# Altium schematic sheet SAM3X-MCU.SchDoc
size A2; DocumentNumber: 1; SheetNumber: 2; SheetTotal: 8
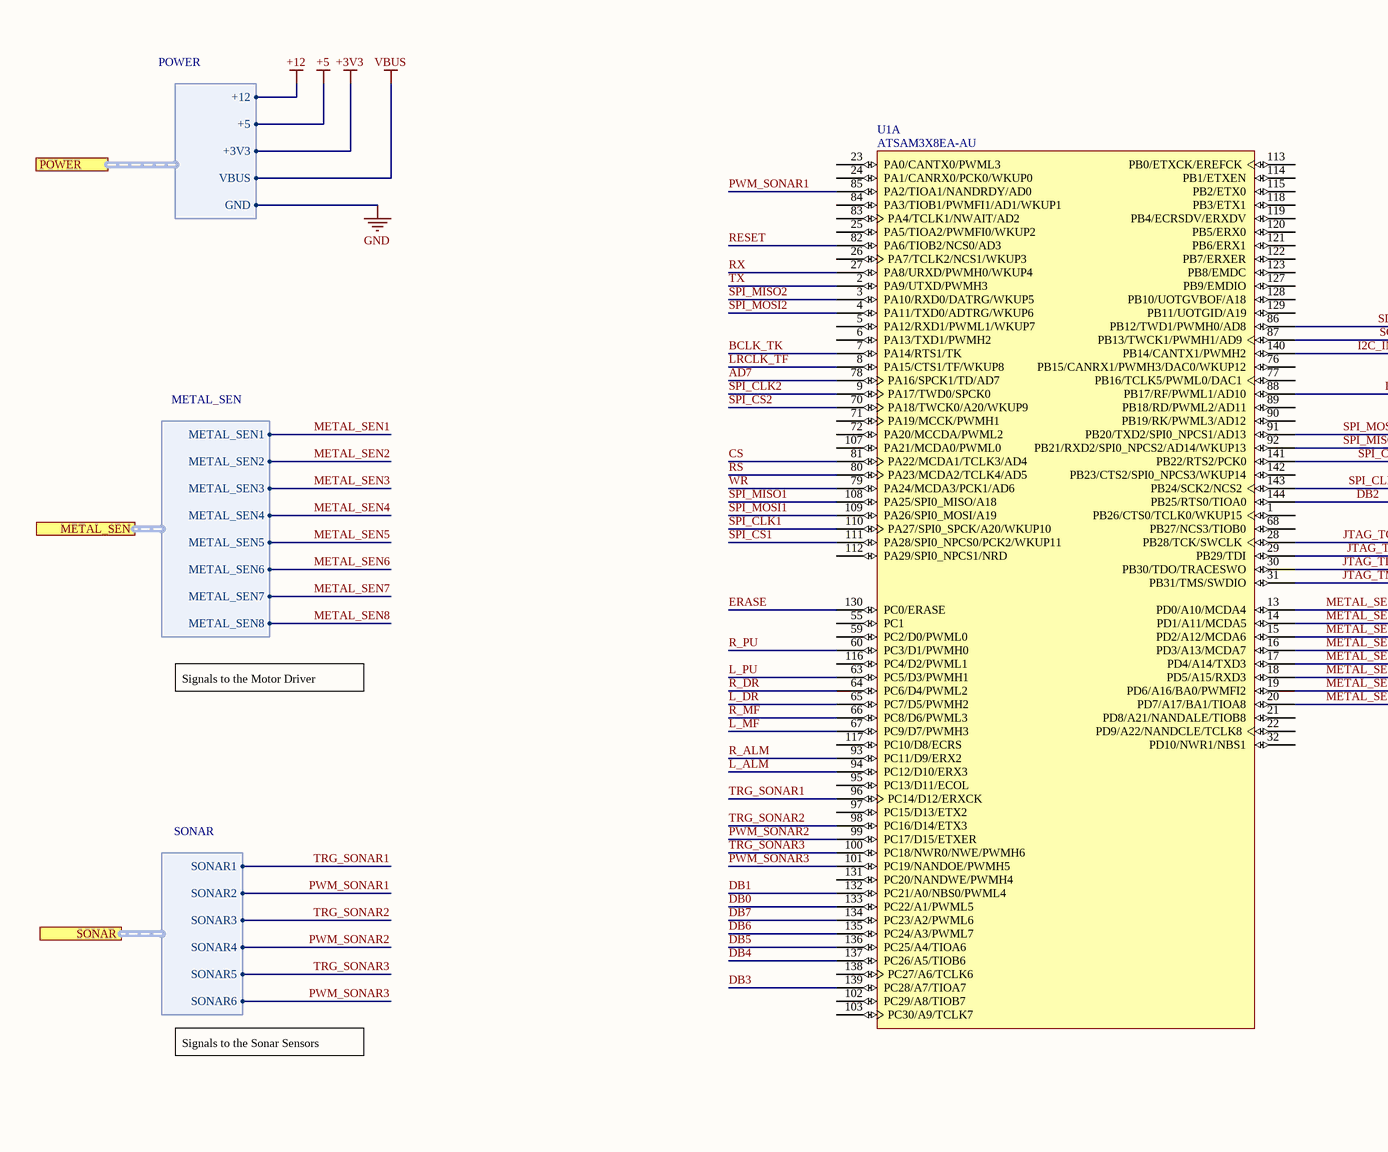
[diagram p0: SAM3X-MCU.SchDoc, left]
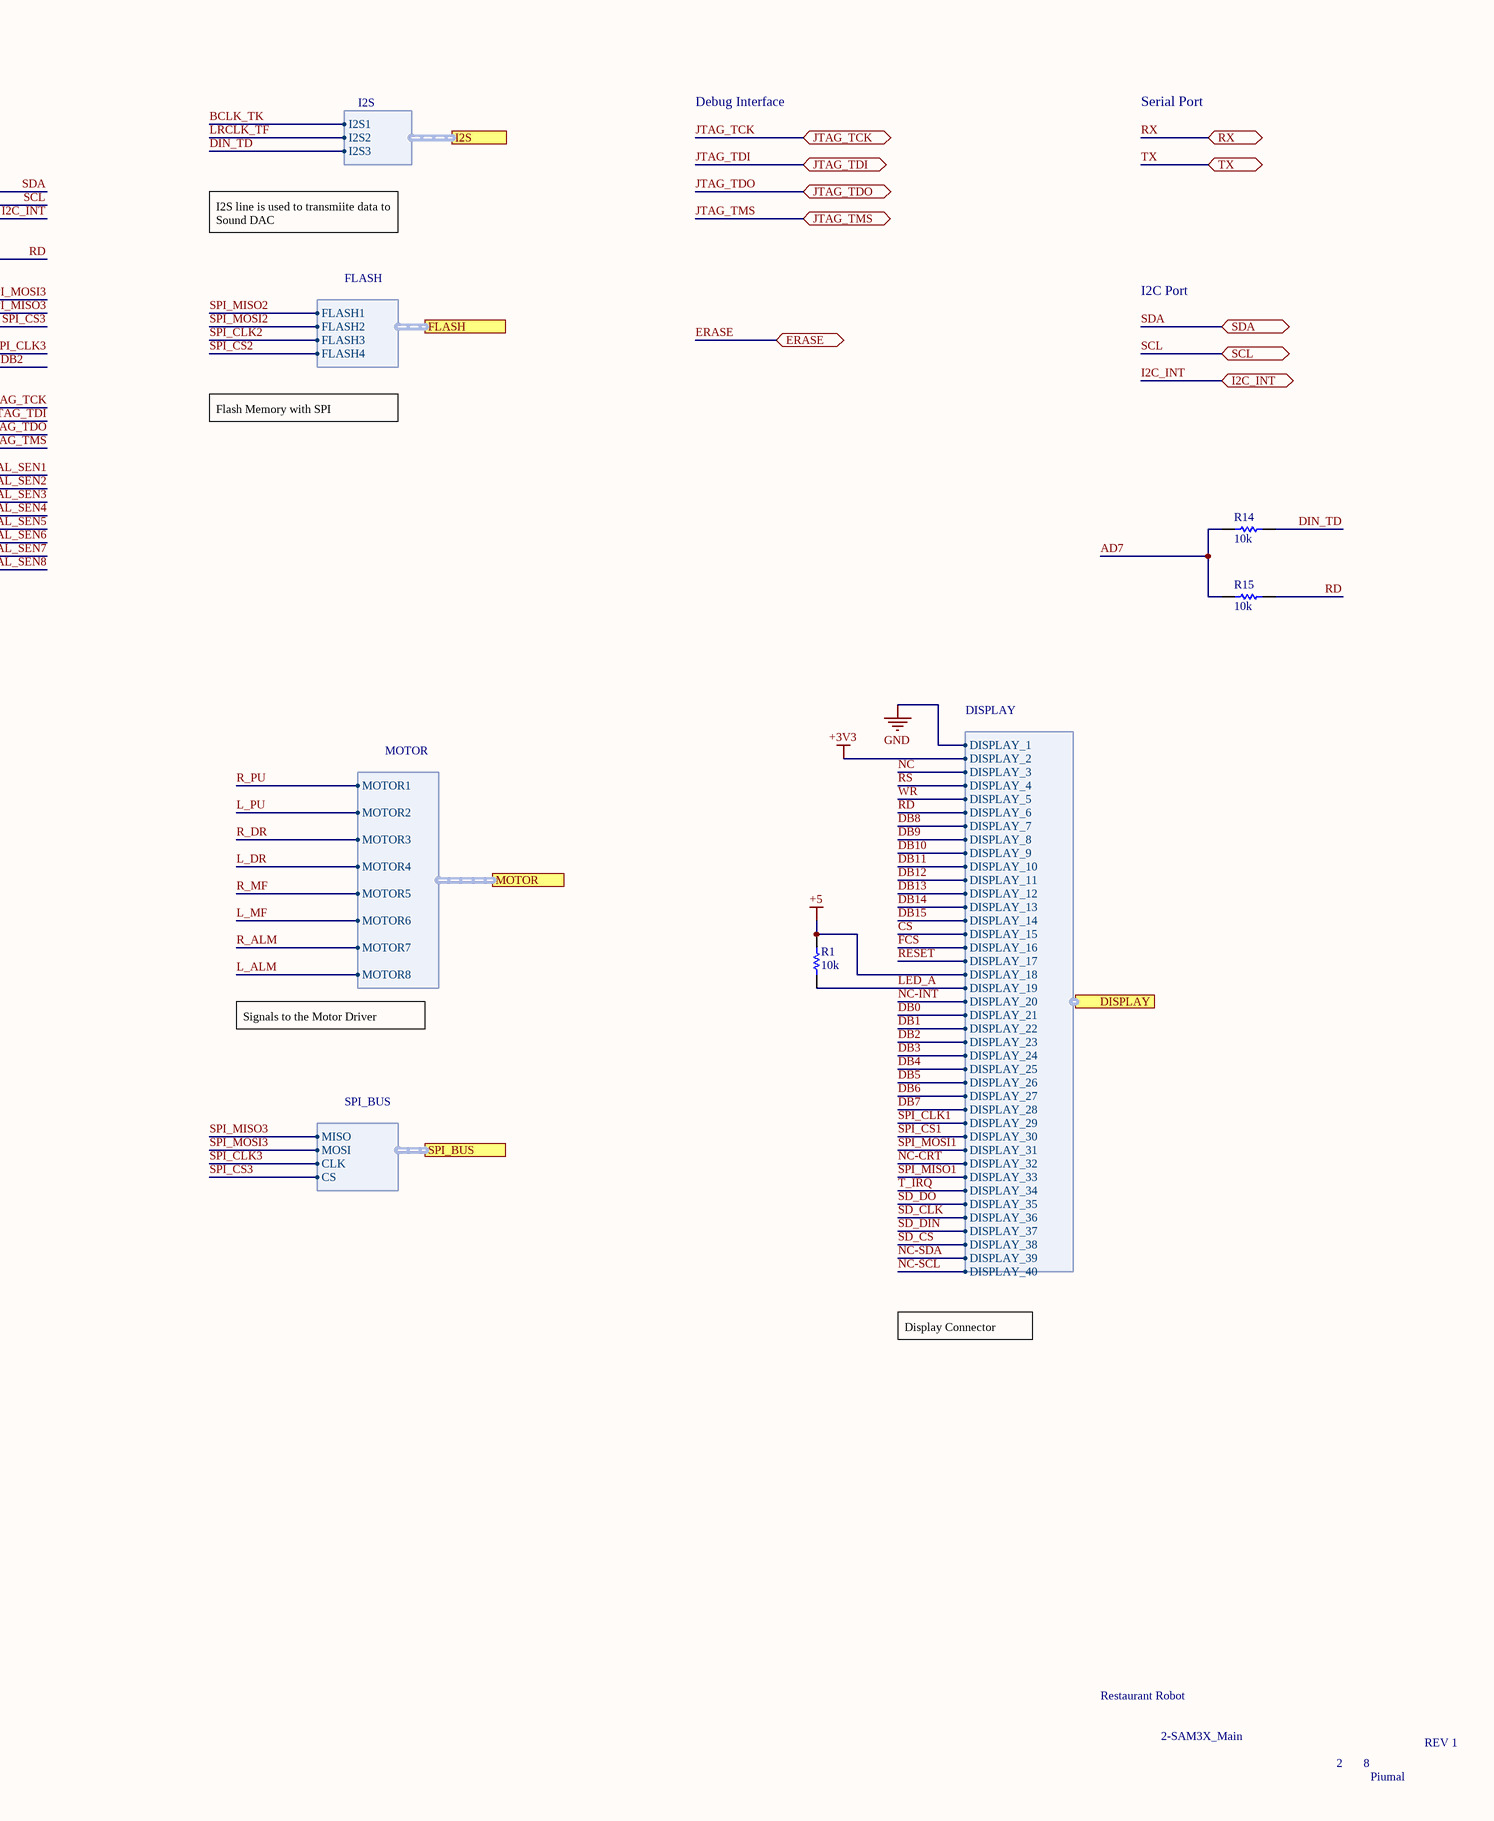
[diagram p1: SAM3X-MCU.SchDoc, right]

## Parts
R1  Resistance: 10k  [RESC2013X60X35ML10T20]  (hidden comment: RC0805JR-0710KL)
R14  Resistance: 10k  [RESC2013X60X35ML10T20]  (hidden comment: RC0805JR-0710KL)
R15  Resistance: 10k  [RESC2013X60X35ML10T20]  (hidden comment: RC0805JR-0710KL)
U1  ATSAM3X8EA-AU  [LQFP144_M]  (part A of 3)

## Ports
DISPLAY (harness DISPLAY), ERASE (bidir), FLASH (harness FLASH), I2C_INT (bidir), I2S (harness I2S), JTAG_TCK (bidir), JTAG_TDI (bidir), JTAG_TDO (bidir), JTAG_TMS (bidir), METAL_SEN (harness METAL_SEN), MOTOR (harness MOTOR), POWER (harness POWER), RX (bidir), SCL (bidir), SDA (bidir), SONAR (harness SONAR), SPI_BUS (harness SPI_BUS), TX (bidir)

## Harnesses
MOTOR: MOTOR1, MOTOR2, MOTOR3, MOTOR4, MOTOR5, MOTOR6, MOTOR7, MOTOR8
FLASH: FLASH1, FLASH2, FLASH3, FLASH4
SONAR: SONAR1, SONAR2, SONAR3, SONAR4, SONAR5, SONAR6
I2S: I2S1, I2S2, I2S3
METAL_SEN: METAL_SEN1, METAL_SEN2, METAL_SEN3, METAL_SEN4, METAL_SEN5, METAL_SEN6, METAL_SEN7, METAL_SEN8
DISPLAY: DISPLAY_1, DISPLAY_2, DISPLAY_3, DISPLAY_4, DISPLAY_5, DISPLAY_6, DISPLAY_7, DISPLAY_8, DISPLAY_9, DISPLAY_10, DISPLAY_11, DISPLAY_12, DISPLAY_13, DISPLAY_14, DISPLAY_15, DISPLAY_16, DISPLAY_18, DISPLAY_17, DISPLAY_19, DISPLAY_20, DISPLAY_21, DISPLAY_22, DISPLAY_23, DISPLAY_24, DISPLAY_25, DISPLAY_26, DISPLAY_27, DISPLAY_28, DISPLAY_29, DISPLAY_30, DISPLAY_31, DISPLAY_32, DISPLAY_33, DISPLAY_34, DISPLAY_35, DISPLAY_36, DISPLAY_37, DISPLAY_39, DISPLAY_38, DISPLAY_40
SPI_BUS: MISO, MOSI, CLK, CS
POWER: +3V3, GND, +5, VBUS, +12

## Nets
+3V3: port DISPLAY.DISPLAY_2, port POWER.+3V3
+5: R1.2 ; port DISPLAY.DISPLAY_18, port POWER.+5
+12: port POWER.+12
GND: port DISPLAY.DISPLAY_1, port POWER.GND
VBUS: port POWER.VBUS
AD7: R14.2 R15.2 U1.78(PA16/SPCK1/TD/AD7)
BCLK_TK: U1.7(PA14/RTS1/TK) ; port I2S.I2S1
CS: U1.81(PA22/MCDA1/TCLK3/AD4) ; port DISPLAY.DISPLAY_15
DB0: U1.133(PC22/A1/PWML5) ; port DISPLAY.DISPLAY_21
DB1: U1.132(PC21/A0/NBS0/PWML4) ; port DISPLAY.DISPLAY_22
DB2: U1.144(PB25/RTS0/TIOA0) ; port DISPLAY.DISPLAY_23
DB3: U1.139(PC28/A7/TIOA7) ; port DISPLAY.DISPLAY_24
DB4: U1.137(PC26/A5/TIOB6) ; port DISPLAY.DISPLAY_25
DB5: U1.136(PC25/A4/TIOA6) ; port DISPLAY.DISPLAY_26
DB6: U1.135(PC24/A3/PWML7) ; port DISPLAY.DISPLAY_27
DB7: U1.134(PC23/A2/PWML6) ; port DISPLAY.DISPLAY_28
DB8: port DISPLAY.DISPLAY_7
DB9: port DISPLAY.DISPLAY_8
DB10: port DISPLAY.DISPLAY_9
DB11: port DISPLAY.DISPLAY_10
DB12: port DISPLAY.DISPLAY_11
DB13: port DISPLAY.DISPLAY_12
DB14: port DISPLAY.DISPLAY_13
DB15: port DISPLAY.DISPLAY_14
DIN_TD: R14.1 ; port I2S.I2S3
ERASE: U1.130(PC0/ERASE) ; port ERASE
FCS: port DISPLAY.DISPLAY_16
I2C_INT: U1.140(PB14/CANTX1/PWMH2) ; port I2C_INT
JTAG_TCK: U1.28(PB28/TCK/SWCLK) ; port JTAG_TCK
JTAG_TDI: U1.29(PB29/TDI) ; port JTAG_TDI
JTAG_TDO: U1.30(PB30/TDO/TRACESWO) ; port JTAG_TDO
JTAG_TMS: U1.31(PB31/TMS/SWDIO) ; port JTAG_TMS
L_ALM: U1.94(PC12/D10/ERX3) ; port MOTOR.MOTOR8
L_DR: U1.65(PC7/D5/PWMH2) ; port MOTOR.MOTOR4
L_MF: U1.67(PC9/D7/PWMH3) ; port MOTOR.MOTOR6
L_PU: U1.63(PC5/D3/PWMH1) ; port MOTOR.MOTOR2
LED_A: R1.1 ; port DISPLAY.DISPLAY_19
LRCLK_TF: U1.8(PA15/CTS1/TF/WKUP8) ; port I2S.I2S2
METAL_SEN1: U1.13(PD0/A10/MCDA4) ; port METAL_SEN.METAL_SEN1
METAL_SEN2: U1.14(PD1/A11/MCDA5) ; port METAL_SEN.METAL_SEN2
METAL_SEN3: U1.15(PD2/A12/MCDA6) ; port METAL_SEN.METAL_SEN3
METAL_SEN4: U1.16(PD3/A13/MCDA7) ; port METAL_SEN.METAL_SEN4
METAL_SEN5: U1.17(PD4/A14/TXD3) ; port METAL_SEN.METAL_SEN5
METAL_SEN6: U1.18(PD5/A15/RXD3) ; port METAL_SEN.METAL_SEN6
METAL_SEN7: U1.19(PD6/A16/BA0/PWMFI2) ; port METAL_SEN.METAL_SEN7
METAL_SEN8: U1.20(PD7/A17/BA1/TIOA8) ; port METAL_SEN.METAL_SEN8
NC: port DISPLAY.DISPLAY_3
NC-CRT: port DISPLAY.DISPLAY_32
NC-INT: port DISPLAY.DISPLAY_20
NC-SCL: port DISPLAY.DISPLAY_40
NC-SDA: port DISPLAY.DISPLAY_39
PWM_SONAR1: U1.85(PA2/TIOA1/NANDRDY/AD0) ; port SONAR.SONAR2
PWM_SONAR2: U1.99(PC17/D15/ETXER) ; port SONAR.SONAR4
PWM_SONAR3: U1.101(PC19/NANDOE/PWMH5) ; port SONAR.SONAR6
R_ALM: U1.93(PC11/D9/ERX2) ; port MOTOR.MOTOR7
R_DR: U1.64(PC6/D4/PWML2) ; port MOTOR.MOTOR3
R_MF: U1.66(PC8/D6/PWML3) ; port MOTOR.MOTOR5
R_PU: U1.60(PC3/D1/PWMH0) ; port MOTOR.MOTOR1
RD: R15.1 U1.88(PB17/RF/PWML1/AD10) ; port DISPLAY.DISPLAY_6
RESET: U1.82(PA6/TIOB2/NCS0/AD3) ; port DISPLAY.DISPLAY_17
RS: U1.80(PA23/MCDA2/TCLK4/AD5) ; port DISPLAY.DISPLAY_4
RX: U1.27(PA8/URXD/PWMH0/WKUP4) ; port RX
SCL: U1.87(PB13/TWCK1/PWMH1/AD9) ; port SCL
SD_CLK: port DISPLAY.DISPLAY_36
SD_CS: port DISPLAY.DISPLAY_38
SD_DIN: port DISPLAY.DISPLAY_37
SD_DO: port DISPLAY.DISPLAY_35
SDA: U1.86(PB12/TWD1/PWMH0/AD8) ; port SDA
SPI_CLK1: U1.110(PA27/SPI0_SPCK/A20/WKUP10) ; port DISPLAY.DISPLAY_29
SPI_CLK2: U1.9(PA17/TWD0/SPCK0) ; port FLASH.FLASH3
SPI_CLK3: U1.143(PB24/SCK2/NCS2) ; port SPI_BUS.CLK
SPI_CS1: U1.111(PA28/SPI0_NPCS0/PCK2/WKUP11) ; port DISPLAY.DISPLAY_30
SPI_CS2: U1.70(PA18/TWCK0/A20/WKUP9) ; port FLASH.FLASH4
SPI_CS3: U1.141(PB22/RTS2/PCK0) ; port SPI_BUS.CS
SPI_MISO1: U1.108(PA25/SPI0_MISO/A18) ; port DISPLAY.DISPLAY_33
SPI_MISO2: U1.3(PA10/RXD0/DATRG/WKUP5) ; port FLASH.FLASH1
SPI_MISO3: U1.92(PB21/RXD2/SPI0_NPCS2/AD14/WKUP13) ; port SPI_BUS.MISO
SPI_MOSI1: U1.109(PA26/SPI0_MOSI/A19) ; port DISPLAY.DISPLAY_31
SPI_MOSI2: U1.4(PA11/TXD0/ADTRG/WKUP6) ; port FLASH.FLASH2
SPI_MOSI3: U1.91(PB20/TXD2/SPI0_NPCS1/AD13) ; port SPI_BUS.MOSI
T_IRQ: port DISPLAY.DISPLAY_34
TRG_SONAR1: U1.96(PC14/D12/ERXCK) ; port SONAR.SONAR1
TRG_SONAR2: U1.98(PC16/D14/ETX3) ; port SONAR.SONAR3
TRG_SONAR3: U1.100(PC18/NWR0/NWE/PWMH6) ; port SONAR.SONAR5
TX: U1.2(PA9/UTXD/PWMH3) ; port TX
WR: U1.79(PA24/MCDA3/PCK1/AD6) ; port DISPLAY.DISPLAY_5

Not connected (* = marked no-connect by the designer): U1 1(PB26/CTS0/TCLK0/WKUP15) 5(PA12/RXD1/PWML1/WKUP7) 6(PA13/TXD1/PWMH2) 21(PD8/A21/NANDALE/TIOB8) 22(PD9/A22/NANDCLE/TCLK8) 23(PA0/CANTX0/PWML3) 24(PA1/CANRX0/PCK0/WKUP0) 25(PA5/TIOA2/PWMFI0/WKUP2) 26(PA7/TCLK2/NCS1/WKUP3) 32(PD10/NWR1/NBS1) 55(PC1) 59(PC2/D0/PWML0) 68(PB27/NCS3/TIOB0) 71(PA19/MCCK/PWMH1) 72(PA20/MCCDA/PWML2) 76(PB15/CANRX1/PWMH3/DAC0/WKUP12) 77(PB16/TCLK5/PWML0/DAC1) 83(PA4/TCLK1/NWAIT/AD2) 84(PA3/TIOB1/PWMFI1/AD1/WKUP1) 89(PB18/RD/PWML2/AD11) 90(PB19/RK/PWML3/AD12) 95(PC13/D11/ECOL) 97(PC15/D13/ETX2) 102(PC29/A8/TIOB7) 103(PC30/A9/TCLK7) 107(PA21/MCDA0/PWML0) 112(PA29/SPI0_NPCS1/NRD) 113(PB0/ETXCK/EREFCK) 114(PB1/ETXEN) 115(PB2/ETX0) 116(PC4/D2/PWML1) 117(PC10/D8/ECRS) 118(PB3/ETX1) 119(PB4/ECRSDV/ERXDV) 120(PB5/ERX0) 121(PB6/ERX1) 122(PB7/ERXER) 123(PB8/EMDC) 127(PB9/EMDIO) 128(PB10/UOTGVBOF/A18) 129(PB11/UOTGID/A19) 131(PC20/NANDWE/PWMH4) 138(PC27/A6/TCLK6) 142(PB23/CTS2/SPI0_NPCS3/WKUP14)

## Notes on the sheet
- Debug Interface
- Serial Port
- I2S line is used to transmiite data to Sound DAC
- I2C Port
- Flash Memory with SPI
- Signals to the Motor Driver
- Signals to the Sonar Sensors
- Display Connector
- Restaurant Robot
- 2-SAM3X_Main
- 2
- 8
- Piumal
- REV 1

## Library data of the parts
R1 R14 R15 = CMP-2000-05025-1: Chip Resistor, 10 KOhm, +/- 5%, 0.125 W, -55 to 155 degC, 0805 (2012 Metric), RoHS, Tape and Reel; Manufacturer: Yageo; Resistor Element Type: ThickFilm; Voltage Rating: 150V; Product Range: RCSeries; SVHC: ToBeAdvised; Resistor Case Style: 0805[2012Metric]; Temperature Coefficient: ±100ppm/degC; Power Rating: 250mW; Automotive Qualification Standard: -; Datasheet Version: REV. 2, 09/2004; Packaging: CutTape; Resistance Tolerance: ±5%; MSL: MSL1-Unlimited; Manufacturer URL: http://www.yageo.com/; Datasheet URL: http://www.yageo.ru/pdf/RC0805.pdf; Package Description: 2-Pin Surface Mounted Device, Body 2 x 1.25 mm; Package Reference: 805
U1 = CMP-0076-00188-1: SAM3X ARM Cortex-M3 Flash-based Microcontroller, 512 KB Flash, 96 KB SRAM, 103 User I/Os, 1.62 to 3.6 V, -40 to 85 degC, 144-Pin LQFP, RoHS; Manufacturer: Atmel; UART: 5; Max. Operating Freq.: 84 MHz; ADC Resolution: 12 bits; Flash: 512 Kbytes; ADC Channels: 16; SRAM: 96 Kbytes; Max I/O Pins: 103; DAC Channels: 2; SPI: 4; # of Touch Channels: 32; Mounting Technology: Surface Mount; Operating Voltage: 1.62 to 3.6 V; ComponentLink2URL: http://www.atmel.com/Images/doc11057.pdf; CAN: 2; ComponentLink1Description: Manufacturer URL; RoHS: TRUE; PartNumber: ATSAM3X8EA-AU; Temp. Range: -40 to 85 degC; PackageVersion: 11057B; PackageDescription: 100-Pin Quad Flat Package, Body 20 x 20 mm, Pitch 0.5 mm; ComponentLink2Description: Datasheet; DatasheetVersion: 11057B; ComponentLink1URL: http://www.atmel.com/; ComponentLink3Description: Package Specification; ComponentLink3URL: http://www.atmel.com/Images/doc11057.pdf; PackageReference: LQFP-144